# EAGLE schematic Type1sch (EAGLE 9.7.0)
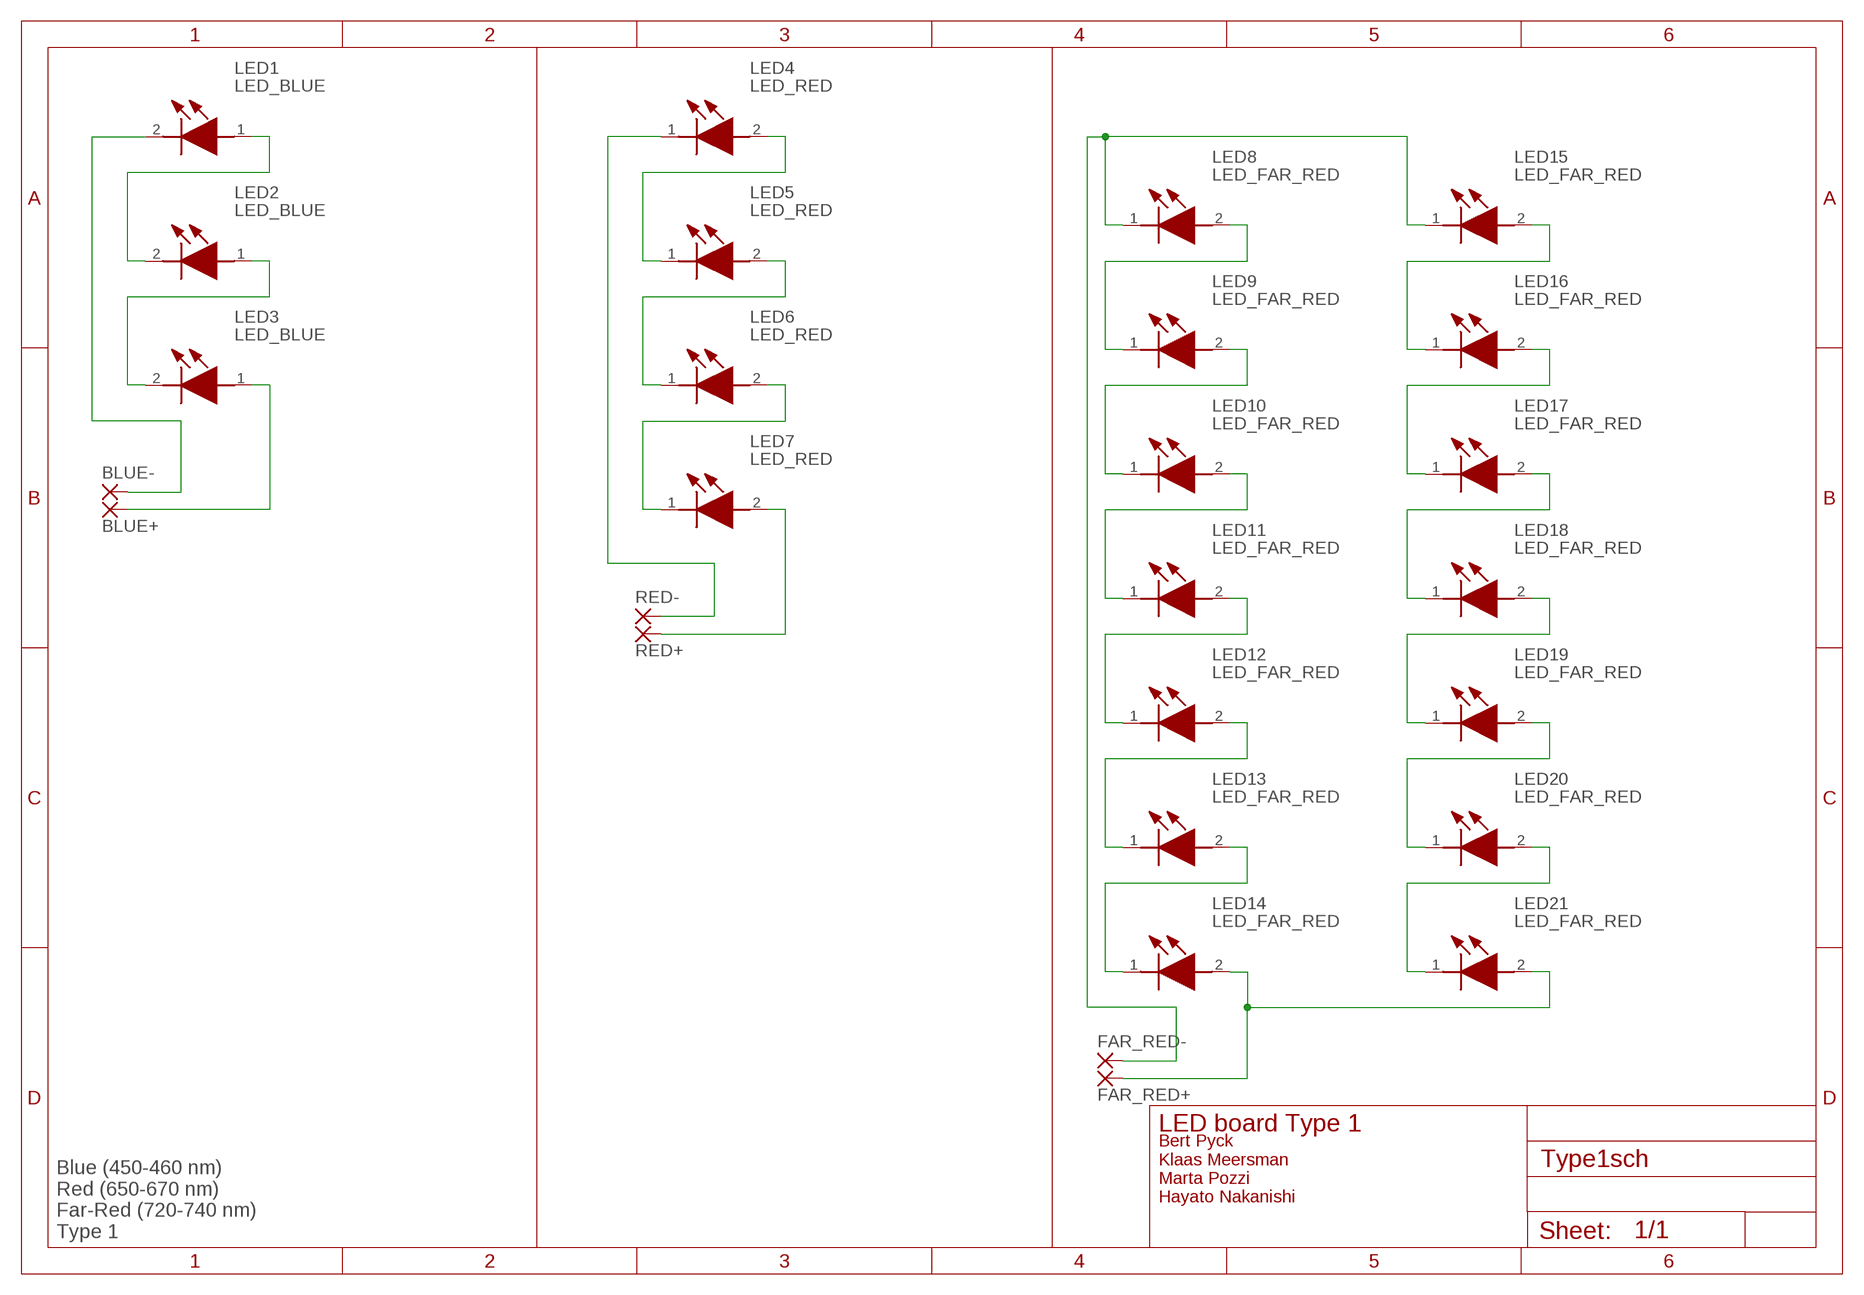
[diagram p0: schematic, sheet 1]

## Parts
BLUE+  SOLDERPAD  [SOLDERPAD]
BLUE-  SOLDERPAD  [SOLDERPAD]
FAR_RED+  SOLDERPAD  [SOLDERPAD]
FAR_RED-  SOLDERPAD  [SOLDERPAD]
LED1  LED_BLUE  [LED_BLUE]
LED2  LED_BLUE  [LED_BLUE]
LED3  LED_BLUE  [LED_BLUE]
LED4  LED_RED  [LED_RED]
LED5  LED_RED  [LED_RED]
LED6  LED_RED  [LED_RED]
LED7  LED_RED  [LED_RED]
LED8  LED_FAR_RED  [LED_FAR_RED]
LED9  LED_FAR_RED  [LED_FAR_RED]
LED10  LED_FAR_RED  [LED_FAR_RED]
LED11  LED_FAR_RED  [LED_FAR_RED]
LED12  LED_FAR_RED  [LED_FAR_RED]
LED13  LED_FAR_RED  [LED_FAR_RED]
LED14  LED_FAR_RED  [LED_FAR_RED]
LED15  LED_FAR_RED  [LED_FAR_RED]
LED16  LED_FAR_RED  [LED_FAR_RED]
LED17  LED_FAR_RED  [LED_FAR_RED]
LED18  LED_FAR_RED  [LED_FAR_RED]
LED19  LED_FAR_RED  [LED_FAR_RED]
LED20  LED_FAR_RED  [LED_FAR_RED]
LED21  LED_FAR_RED  [LED_FAR_RED]
RED+  SOLDERPAD  [SOLDERPAD]
RED-  SOLDERPAD  [SOLDERPAD]

## Nets
N$1: BLUE+.1(P) LED3.1(A)
N$2: LED2.1(A) LED3.2(K)
N$3: LED1.1(A) LED2.2(K)
N$4: BLUE-.1(P) LED1.2(K)
N$5: LED7.2(A) RED+.1(P)
N$6: LED6.2(A) LED7.1(K)
N$7: LED5.2(A) LED6.1(K)
N$8: LED4.2(A) LED5.1(K)
N$9: LED4.1(K) RED-.1(P)
N$10: FAR_RED+.1(P) LED14.2(A) LED21.2(A)
N$11: LED13.2(A) LED14.1(K)
N$12: LED12.2(A) LED13.1(K)
N$13: LED11.2(A) LED12.1(K)
N$14: LED10.2(A) LED11.1(K)
N$15: LED9.2(A) LED10.1(K)
N$16: LED8.2(A) LED9.1(K)
N$17: FAR_RED-.1(P) LED8.1(K) LED15.1(K)
N$18: LED20.2(A) LED21.1(K)
N$19: LED19.2(A) LED20.1(K)
N$20: LED18.2(A) LED19.1(K)
N$21: LED17.2(A) LED18.1(K)
N$22: LED16.2(A) LED17.1(K)
N$23: LED15.2(A) LED16.1(K)

## Notes on the sheet
- LED board Type 1
- Bert Pyck
  Klaas Meersman
  Marta Pozzi
  Hayato Nakanishi
- Blue (450-460 nm)
  Red (650-670 nm)
  Far-Red (720-740 nm)
  Type 1

## Library data of the parts
BLUE+ BLUE- FAR_RED+ FAR_RED- RED+ RED- = LibraryLEDs:SOLDERPAD: SMD PAD
LED1-LED3 = LibraryLEDs:LED_BLUE: Mid-Power LEDs - Single Colour 2835 Mid-Power ColorRoyal Blue 440-460nm Source: Datasheet <https://downloads.cree-led.com/files/ds/j/JSeries-2835-Color.pdf>; DESCRIPTION: Mid-Power LEDs - Single Colour 2835 Mid-Power ColorRoyal Blue 440-460nm; HEIGHT: 0.8mm; MANUFACTURER_NAME: Wolfspeed; MANUFACTURER_PART_NUMBER: JE2835ARY-N-0002A0000-N0000001; MOUSER_PART_NUMBER: 941-JE2835ARYN02AN; MOUSER_PRICE-STOCK: https://www.mouser.co.uk/ProductDetail/Cree-LED/JE2835ARY-N-0002A0000-N0000001?qs=tlsG%2FOw5FFjsuj%2F2f9X0HQ%3D%3D
LED4-LED7 = LibraryLEDs:LED_RED: Mid-Power LEDs - Single Colour 2835 Mid-Power ColorPhoto Red 650-670nm Source: Datasheet <https://assets.cree-led.com/a/ds/j/JSeries-2835-Color.pdf>; DESCRIPTION: Mid-Power LEDs - Single Colour 2835 Mid-Power ColorPhoto Red 650-670nm; HEIGHT: 0.8mm; MANUFACTURER_NAME: CREE LED; MANUFACTURER_PART_NUMBER: JE2835AHR-N-0001A0000-N0000001; MOUSER_PART_NUMBER: 941-JE2835AHRN01AN; MOUSER_PRICE-STOCK: https://www.mouser.co.uk/ProductDetail/Cree-LED/JE2835AHR-N-0001A0000-N0000001?qs=tlsG%2FOw5FFjj3bMznpJhRA%3D%3D
LED8-LED21 = LibraryLEDs:LED_FAR_RED: High Power LEDs - Single Color 2835 Mid-Power ColorFar Red 720-740nm Source: Datasheet <https://assets.cree-led.com/a/ds/j/JSeries-2835-Color.pdf>; DESCRIPTION: High Power LEDs - Single Color 2835 Mid-Power ColorFar Red 720-740nm; HEIGHT: mm; MANUFACTURER_NAME: CREE LED; MANUFACTURER_PART_NUMBER: JE2835AFR-N-0001A0000-N0000001; MOUSER_PART_NUMBER: 941-JE2835AFRN01AN; MOUSER_PRICE-STOCK: https://www.mouser.co.uk/ProductDetail/Cree-LED/JE2835AFR-N-0001A0000-N0000001?qs=tlsG%2FOw5FFhxeS5Ond46kw%3D%3D